# EAGLE schematic untitled (EAGLE 9.5.2)
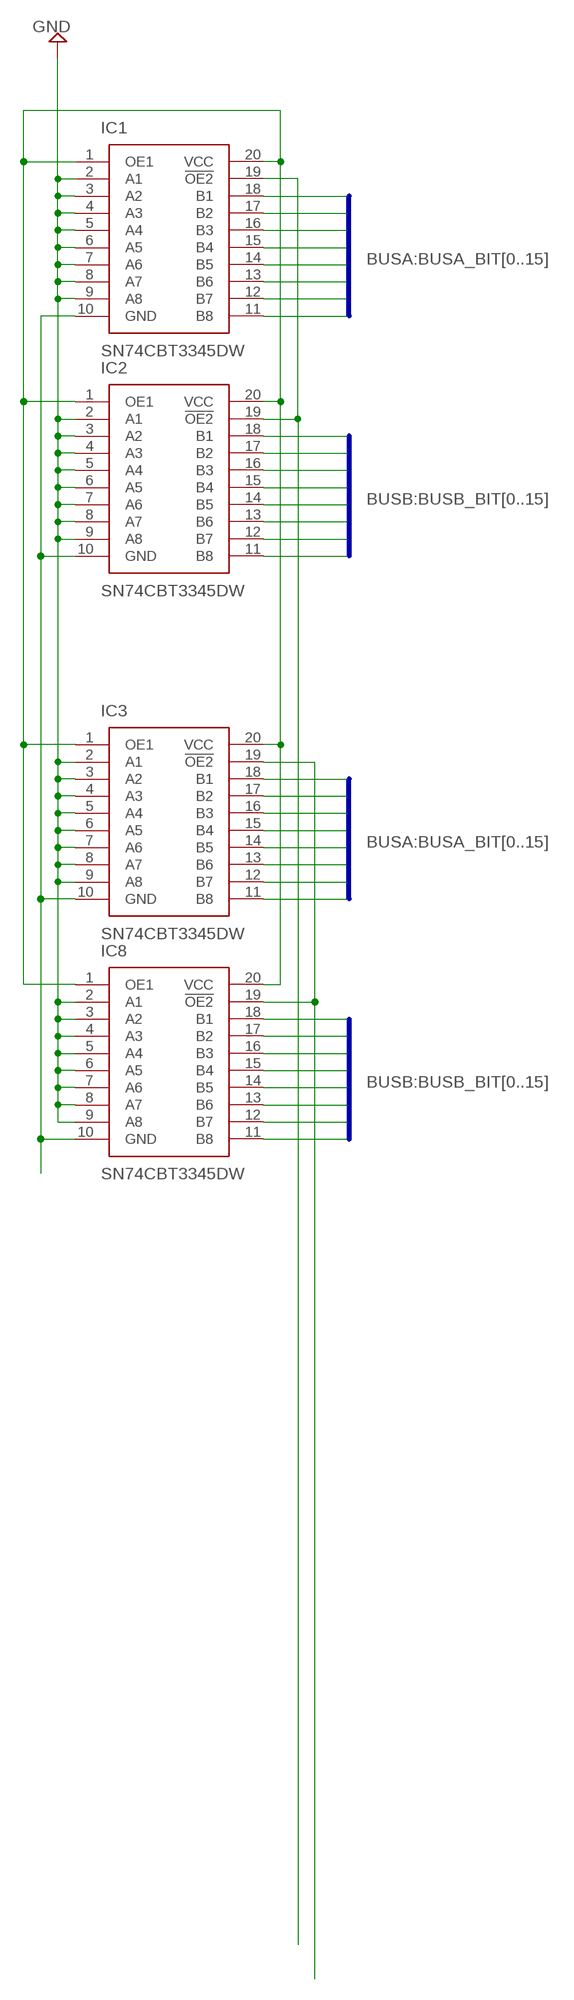
[diagram p0: schematic, sheet 1]

## Parts
IC1  SN74CBT3345DW  [SOIC127P1030X265-20N]
IC2  SN74CBT3345DW  [SOIC127P1030X265-20N]
IC3  SN74CBT3345DW  [SOIC127P1030X265-20N]
IC8  SN74CBT3345DW  [SOIC127P1030X265-20N]

## Nets
BUSA_BIT0: IC1.18(B1)
BUSA_BIT1: IC1.17(B2)
BUSA_BIT2: IC1.16(B3)
BUSA_BIT3: IC1.15(B4)
BUSA_BIT4: IC1.14(B5)
BUSA_BIT5: IC1.13(B6)
BUSA_BIT6: IC1.12(B7)
BUSA_BIT7: IC1.11(B8)
BUSA_BIT8: IC3.18(B1)
BUSA_BIT9: IC3.17(B2)
BUSA_BIT10: IC3.16(B3)
BUSA_BIT11: IC3.15(B4)
BUSA_BIT12: IC3.14(B5)
BUSA_BIT13: IC3.13(B6)
BUSA_BIT14: IC3.12(B7)
BUSA_BIT15: IC3.11(B8)
BUSB_BIT0: IC2.18(B1)
BUSB_BIT1: IC2.17(B2)
BUSB_BIT2: IC2.16(B3)
BUSB_BIT3: IC2.15(B4)
BUSB_BIT4: IC2.14(B5)
BUSB_BIT5: IC2.13(B6)
BUSB_BIT6: IC2.12(B7)
BUSB_BIT7: IC2.11(B8)
BUSB_BIT8: IC8.18(B1)
BUSB_BIT9: IC8.17(B2)
BUSB_BIT10: IC8.16(B3)
BUSB_BIT11: IC8.15(B4)
BUSB_BIT12: IC8.14(B5)
BUSB_BIT13: IC8.13(B6)
BUSB_BIT14: IC8.12(B7)
BUSB_BIT15: IC8.11(B8)
GND: IC1.2(A1) IC1.3(A2) IC1.4(A3) IC1.5(A4) IC1.6(A5) IC1.7(A6) IC1.8(A7) IC1.9(A8) IC2.2(A1) IC2.3(A2) IC2.4(A3) IC2.5(A4) IC2.6(A5) IC2.7(A6) IC2.8(A7) IC2.9(A8) IC3.2(A1) IC3.3(A2) IC3.4(A3) IC3.5(A4) IC3.6(A5) IC3.7(A6) IC3.8(A7) IC3.9(A8) IC8.2(A1) IC8.3(A2) IC8.4(A3) IC8.5(A4) IC8.6(A5) IC8.7(A6) IC8.8(A7) IC8.9(A8)
N$39: IC3.19(!OE2) IC8.19(!OE2)
N$57: IC1.19(!OE2) IC2.19(!OE2)
N$72: IC1.1(OE1) IC1.20(VCC) IC2.1(OE1) IC2.20(VCC) IC3.1(OE1) IC3.20(VCC) IC8.1(OE1) IC8.20(VCC)
N$85: IC1.10(GND) IC2.10(GND) IC3.10(GND) IC8.10(GND)

## Buses
BUSA:BUSA_BIT[0..15]
BUSB:BUSB_BIT[0..15]

## Library data of the parts
IC1-IC3 IC8 = SamacSys_Parts:SN74CBT3345DW: Texas Instruments SN74CBT3345DW, Bus Switch, 8 x 1:1, 4.5 5.5 V, 20-Pin SOIC Source: Datasheet <https://www.ti.com/lit/ds/symlink/sn74cbt3345.pdf>; DESCRIPTION: Texas Instruments SN74CBT3345DW, Bus Switch, 8 x 1:1, 4.5 5.5 V, 20-Pin SOIC; HEIGHT: 2.65mm; MANUFACTURER_NAME: Texas Instruments; MANUFACTURER_PART_NUMBER: SN74CBT3345DW